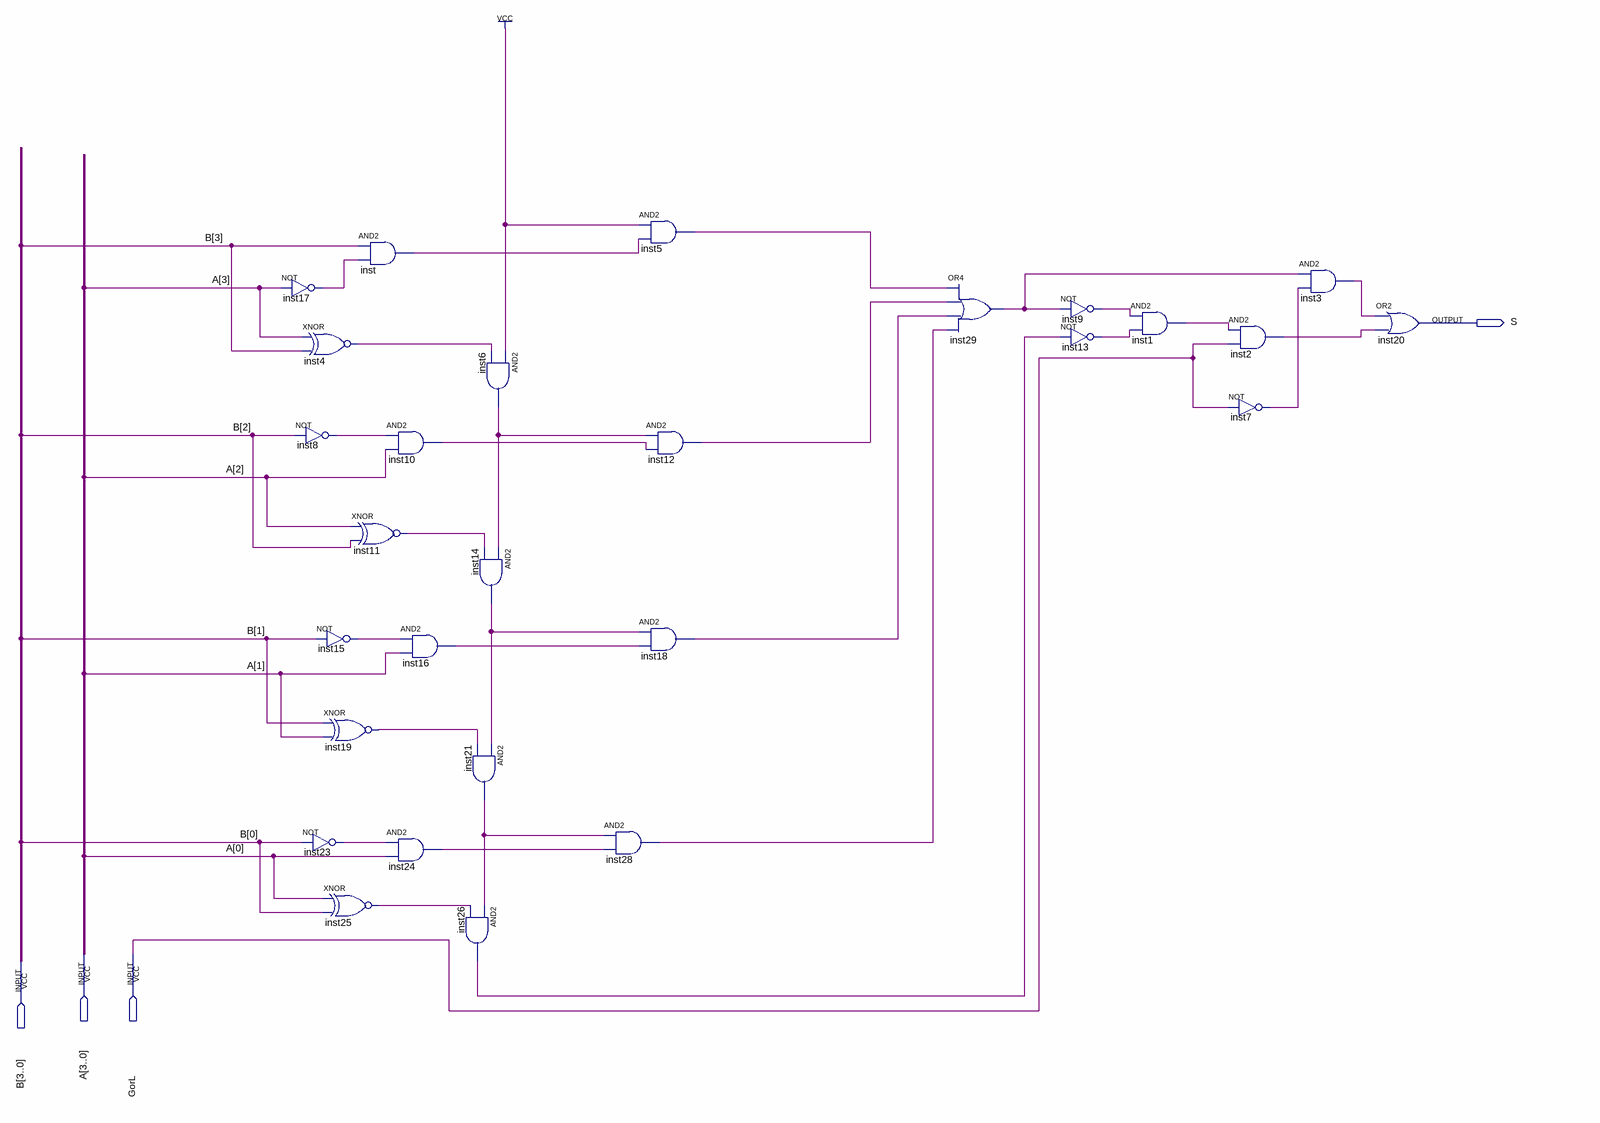
[diagram p0: schematic sheet]
// Quartus schematic MaiorMenor.bdf as structural Verilog: 28 symbols, 4 pins
module MaiorMenor (
  input  [3:0] A,
  input  GorL,
  input  [3:0] B,
  output S
);

  wire inst1_out, inst2_out, inst3_out, inst4_out, inst5_out, inst6_out, inst7_out, inst8_out, inst9_out,
       inst10_out, inst11_out, inst12_out, inst13_out, inst14_out, inst15_out, inst16_out, inst17_out,
       inst18_out, inst19_out, inst21_out, inst23_out, inst24_out, inst25_out, inst26_out, inst28_out,
       inst29_out, inst_out;

  not inst17 (inst17_out, A[3]);
  xnor inst4 (inst4_out, A[3], B[3]);
  not inst8 (inst8_out, B[2]);
  not inst15 (inst15_out, B[1]);
  not inst23 (inst23_out, B[0]);
  and inst (inst_out, B[3], inst17_out);
  xnor inst11 (inst11_out, A[2], B[2]);
  xnor inst19 (inst19_out, B[1], A[1]);
  xnor inst25 (inst25_out, A[0], B[0]);
  and inst10 (inst10_out, inst8_out, A[2]);
  and inst16 (inst16_out, inst15_out, A[1]);
  and inst24 (inst24_out, inst23_out, A[0]);
  and inst6 (inst6_out, 1'b1, inst4_out);
  and inst14 (inst14_out, inst6_out, inst11_out);
  and inst21 (inst21_out, inst14_out, inst19_out);
  and inst26 (inst26_out, inst21_out, inst25_out);
  and inst5 (inst5_out, 1'b1, inst_out);
  and inst12 (inst12_out, inst6_out, inst10_out);
  and inst18 (inst18_out, inst14_out, inst16_out);
  and inst28 (inst28_out, inst21_out, inst24_out);
  or inst29 (inst29_out, inst5_out, inst12_out, inst18_out, inst28_out);
  not inst9 (inst9_out, inst29_out);
  not inst13 (inst13_out, inst26_out);
  and inst1 (inst1_out, inst9_out, inst13_out);
  and inst2 (inst2_out, inst1_out, GorL);
  not inst7 (inst7_out, GorL);
  and inst3 (inst3_out, inst29_out, inst7_out);
  or inst20 (S, inst3_out, inst2_out);
endmodule
